# EAGLE design Power Board (EAGLE 7.3.0)
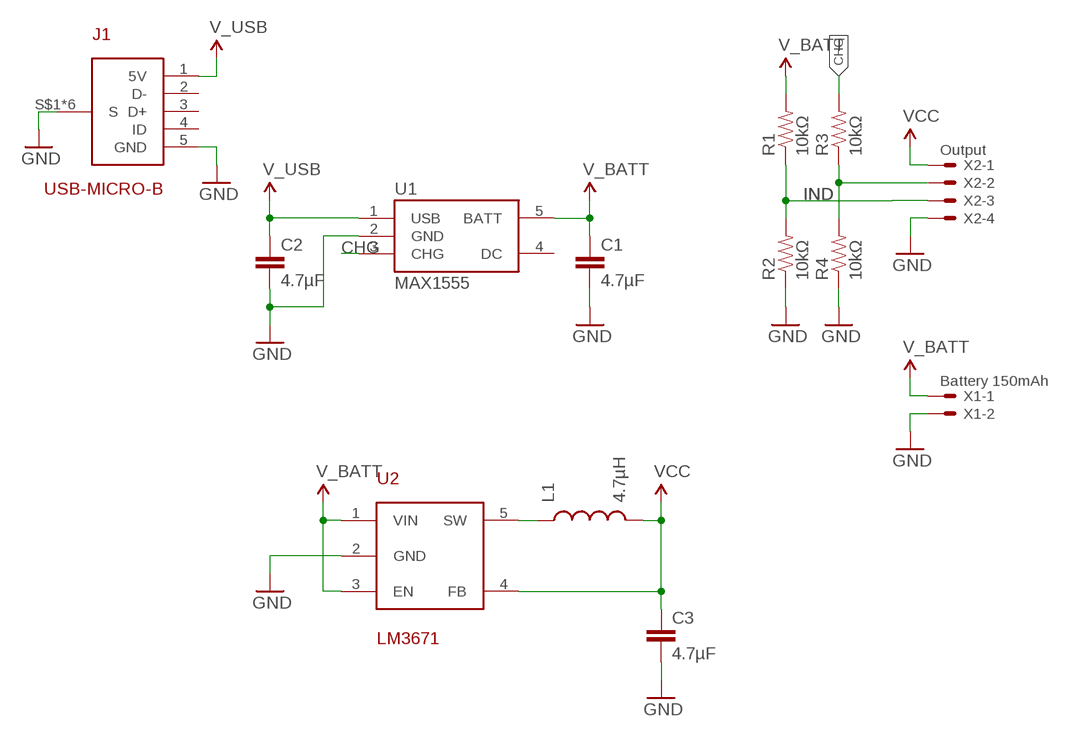
[diagram p0: schematic, sheet 1]

## Parts
C1  4.7µF  CAP0805  [0805]
C2  4.7µF  CAP0805  [0805]
C3  4.7µF  CAP0805  [0805]
J1  USB-MICRO-B  [UB-MC5BR3]
L1  4.7µH  INDUCTOR0805  [0805]
R1  10kΩ  RESISTOR0805-RES  [0805]
R2  10kΩ  RESISTOR0805-RES  [0805]
R3  10kΩ  RESISTOR0805-RES  [0805]
R4  10kΩ  RESISTOR0805-RES  [0805]
U1  MAX1555  [SOT23-5]
U2  LM3671  [SOT23-5]
X1  Battery 150mAh  SM02B-SRSS-TB  [SM02B-SRSS-TB]
X2  Output  SM04B-SRSS-TB  [SM04B-SRSS-TB]

## Nets
CHG: R3.2 U1.3(CHG)
CHG_2: R3.1 R4.2 X2.2
GND: C1.2 C2.2 C3.2 J1.5(GND) J1.S$1(S) J1.S$2(S) J1.S$3(S) J1.S$4(S) J1.S$5(S) J1.S$6(S) R2.1 R4.1 U1.2(GND) U2.2(GND) X1.2 X2.4
IND: R1.1 R2.2 X2.3
N$1: L1.1 U2.5(SW)
V_BATT: C1.1 R1.2 U1.5(BATT) U2.1(VIN) U2.3(EN) X1.1
V_USB: C2.1 J1.1(5V) U1.1(USB)
VCC: C3.1 L1.2 U2.4(FB) X2.1
Unconnected: J1.2(D-) J1.3(D+) J1.4(ID) U1.4(DC)

## Library data of the parts
C1-C3 = SparkFun-Passives:CAP: Capacitor Standard 0603 ceramic capacitor, and 0.1" leaded capacitor.
J1 = Connectors:USB-MICRO-B
L1 = SparkFun-Passives:INDUCTOR: Inductors Basic Inductor/Choke - 0603 and 1206. Footprints are not proven and vary greatly between part numbers. INDUCTOR POWER 3.3UH 4.0A SMD 0.197" L x 0.197" W x 0.177" H (5.00mm x 5.00mm x 4.50mm)
R1-R4 = SparkFun-Passives:RESISTOR: Resistor Basic schematic elements and footprints for 0603, 1206, and PTH resistors.
U1 = SparkFun-PowerIC:MAX1555: MAX1555 Lithium Charger IC SOT-23 Lithium Polymer charging IC. Schematic element and footprint proven. Spark Fun Electronics SKU : COM-00674
U2 = texas-custom:LM3671: Texas Instruments LM3671, LM3671Q 2MHz, 600mA Step-Down DC-DC Converter
X1 = con-jst2:?M02B-SRSS-TB: Disconnectable Crimp style connector, 1.0mm pitch 2 contacts
X2 = con-jst2:?M04B-SRSS-TB: Disconnectable Crimp style connector, 1.0mm pitch 4 contacts

## Board
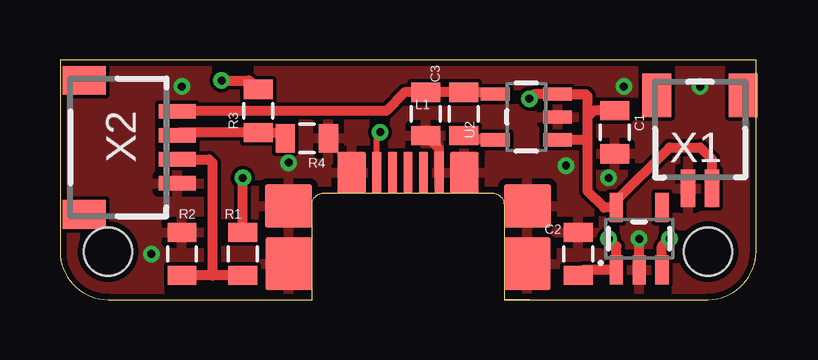
[diagram p1: board, top side]
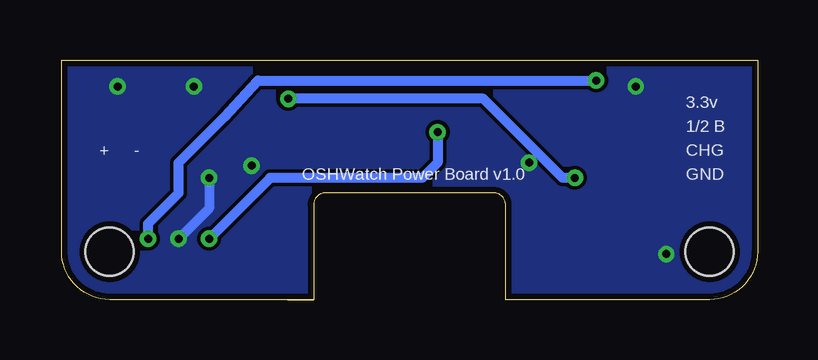
[diagram p2: board, bottom side, seen from below]

Size 29 x 10 mm. Coordinates in mm from the lower left corner, seen from the top.
Outline: 10.5,3.95 10.5,0 2,0 arc-90 0,2 0,10 29,10 29,2 arc-90 27,0 18.5,0 18.5,3.95 arc90 18,4.45 11,4.45 arc90 10.5,3.95
Outline: 10.5,3.95 10.5,4
Copper layers (1*16): Top 0.035mm / dielectric 1.5mm / Bottom 0.035mm
Design rules "default *": minimum track width 6mil, minimum drill 13mil, track to track 6mil, track to pad 6mil, pad to pad 6mil, via to via 6mil, smd to smd 6mil, copper to edge 10mil, drill to drill 8mil, minimum pad ring 7mil, minimum via ring 7mil, stop-mask expansion 4mil, vias tented up to drill 0mil, thermal gap 10mil
Holes 2 mm at 27,2 2,2

### Footprints (pad centres in the part's own frame; a part is rotated, then mirrored left to right if it is on the bottom)
0805 = smd 0.8 x 1.2: 1 -0.9,0; 2 0.9,0
UB-MC5BR3 = smd 0.4 x 1.7: 1 -1.3,5.3; 2 -0.65,5.3; 3 0,5.3; 4 0.65,5.3; 5 1.3,5.3 | smd 1.95 x 2.2: S$1 -4.975,1.5; S$2 4.975,1.5 | smd 1.95 x 1.8: S$3 -4.975,3.9; S$4 4.975,3.9 | smd 1.2 x 1.7: S$5 -2.35,5.3; S$6 2.35,5.3
SOT23-5 = smd 0.55 x 1.2: 1 -0.95,-1.3; 2 0,-1.3; 3 0.95,-1.3; 4 0.95,1.3; 5 -0.95,1.3
SM02B-SRSS-TB = smd 0.6 x 1.55: 1 -0.5,2.975; 2 0.5,2.975 | smd 1.2 x 1.8: FIT@1 -1.8,-0.9; FIT@2 1.8,-0.9
SM04B-SRSS-TB = smd 0.6 x 1.55: 1 -1.5,2.975; 2 -0.5,2.975; 3 0.5,2.975; 4 1.5,2.975 | smd 1.2 x 1.8: FIT@1 -2.8,-0.9; FIT@2 2.8,-0.9

### Placement (x,y rotation side)
C1  23.11,6.99 270 top
C2  21.59,1.91 90 top
C3  15.24,7.75 270 top
J1  14.5,0 0 top
L1  16.83,7.75 90 top
R1  7.62,1.91 90 top
R2  5.08,1.91 270 top
R3  8.26,7.87 90 top
R4  10.29,6.73 180 top
U1  24.13,2.54 0 top
U2  19.43,7.62 90 top
X1  26.67,7.62 180 top
X2  1.91,6.35 270 top

### Tracks (layer width: path | path; a pad name or v marks a point on that pad's centre or on a via)
CHG  (via drill 0.33 pad 0.25, 0.33 pad 0.41)
  Top 0.406: U1.3 25.08,2.23 v25.4,2.54 | v6.73,9.14 7.88,9.14 R3.2
  Bottom 0.406: v25.4,2.54 25.4,3.17 24.13,4.45 24.13,5.71 22.23,7.62 20.83,9.14 v6.73,9.14
CHG_2
  Top 0.406: R4.2 9.14,6.97 R3.1 5,6.97 X2.2
GND  (via drill 0.33 pad 0.25, 0.33 pad 0.41)
  Top 0.406: U1.2 v24.13,2.54 | J1.5 15.8,6.29 C3.2
  Bottom 0.406: v22.86,5.08 22.86,3.81 v24.13,2.54
  other vias: 23.5,8.89 9.53,5.71 3.81,1.91 26.67,8.89 5.08,8.89 21.08,5.59
  pour Top: 0,10 29,10 29,0 19,0 0,0
  pour Bottom: 0,10 29,10 29,0 19,0 0,0
  pour Top: 0,10 29,10 29,0 0,0
IND
  Top 0.406: R1.1 6.35,1 | 6.35,1 R2.2 | X2.3 6.21,5.85 6.35,5.71 6.35,1
N$1
  Top 0.406: U2.5 17,6.67 L1.1
V_BATT  (via drill 0.33 pad 0.33, 0.33 pad 0.41)
  Top 0.406: R1.2 v7.62,5.08 | 21.97,7.62 21.97,8.51 21.91,8.57 U2.3 19.75,8.57 v19.56,8.38 | 21.97,7.62 21.97,6.6 | 21.97,6.6 21.97,4.54 22.67,3.84 U1.5 23.18,4.13 25.4,6.35 26.67,6.35 27.17,5.85 X1.1 | C1.1 22.24,7.88 21.97,7.62 | U2.1 21.91,6.67 21.97,6.6
  Bottom 0.406: v7.62,5.08 8.13,5.08 11.43,8.38 v19.56,8.38
V_USB  (via drill 0.33 pad 0.25)
  Top 0.254: J1.1 13.2,6.85 v13.34,6.99
  Top 0.406: C2.1 21.82,1.24 U1.1 23.18,2.22 v22.86,2.54 | 13.3,6.96 v13.34,6.99
  Bottom 0.406: v13.34,6.99 13.34,5.71 13.97,5.08 20.32,5.08 v22.86,2.54
VCC
  Top 0.406: U2.4 18.05,8.65 L1.2 C3.1 14.36,8.65 13.59,7.87 4.9,7.87 X2.1

### Text on the board
bNames: 3.3v | 1/2 B | CHG | - | + | GND | OSHWatch Power Board v1.0